# Altium schematic sheet MCU.SchDoc
size A; SheetNumber: 4; SheetTotal: 6
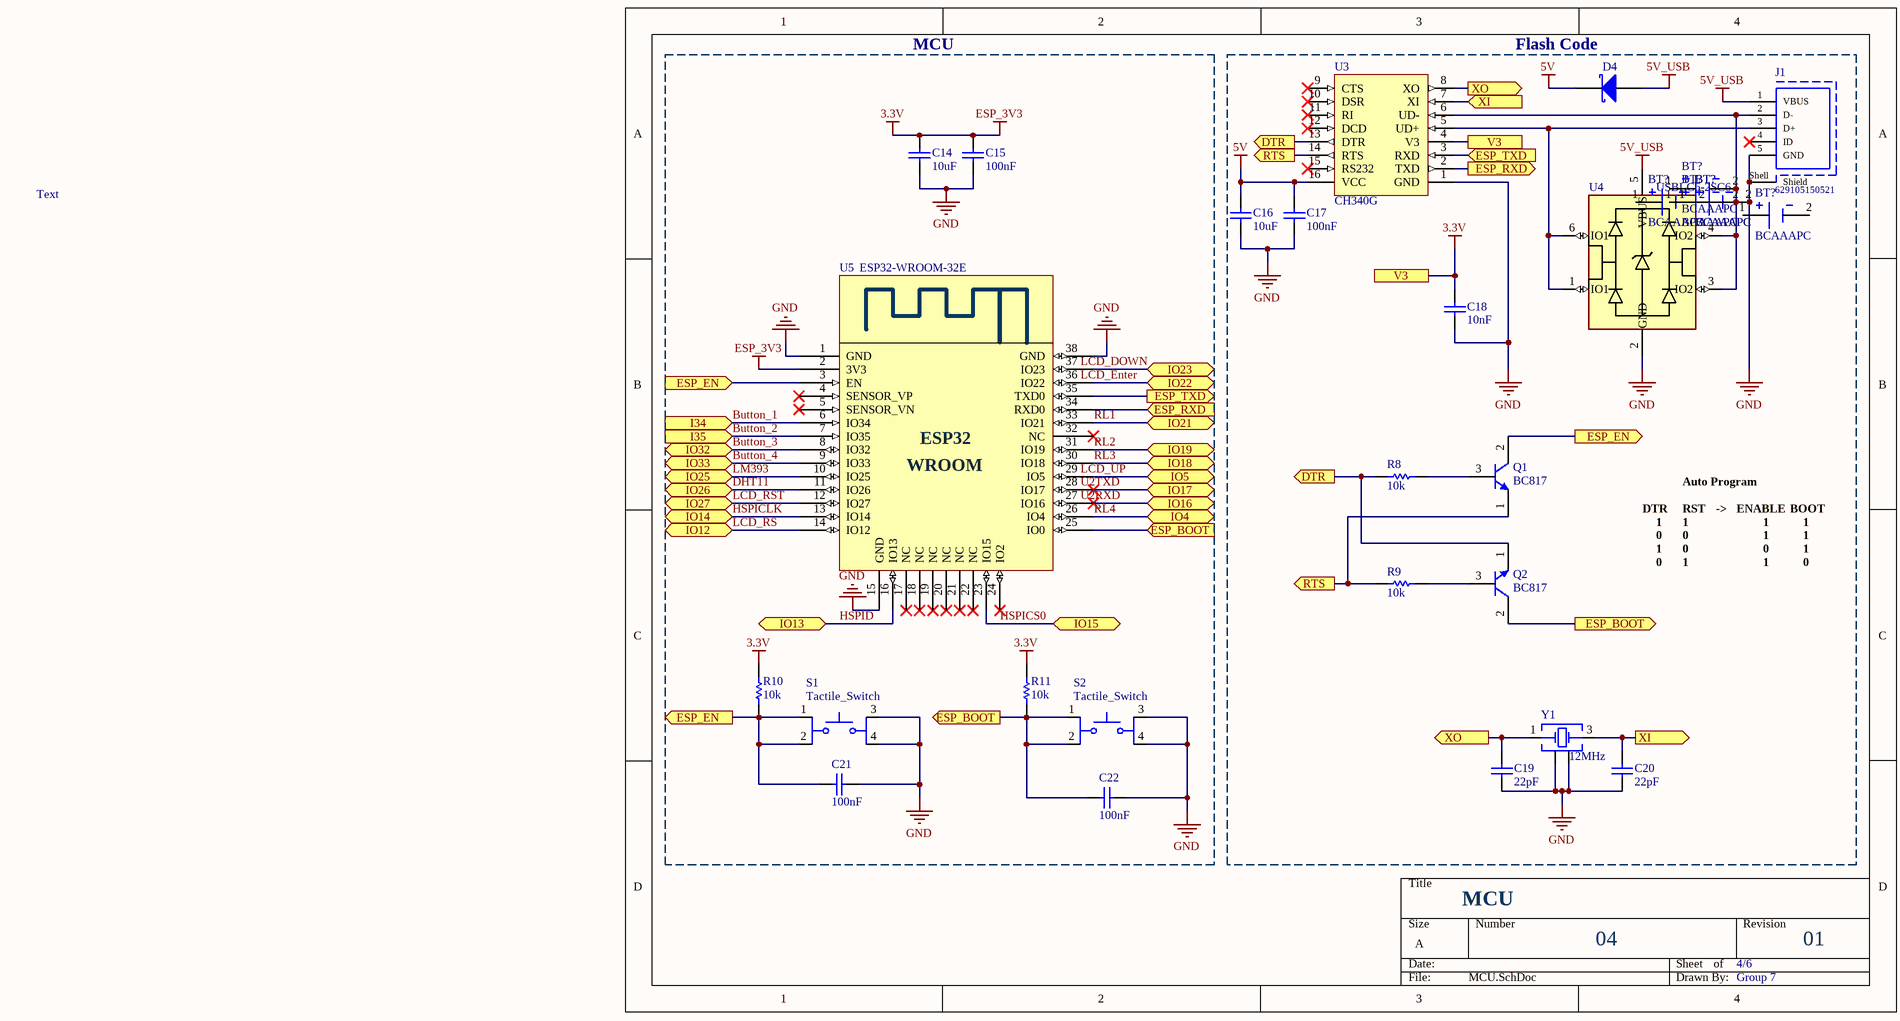
[diagram p0: MCU.SchDoc, left]
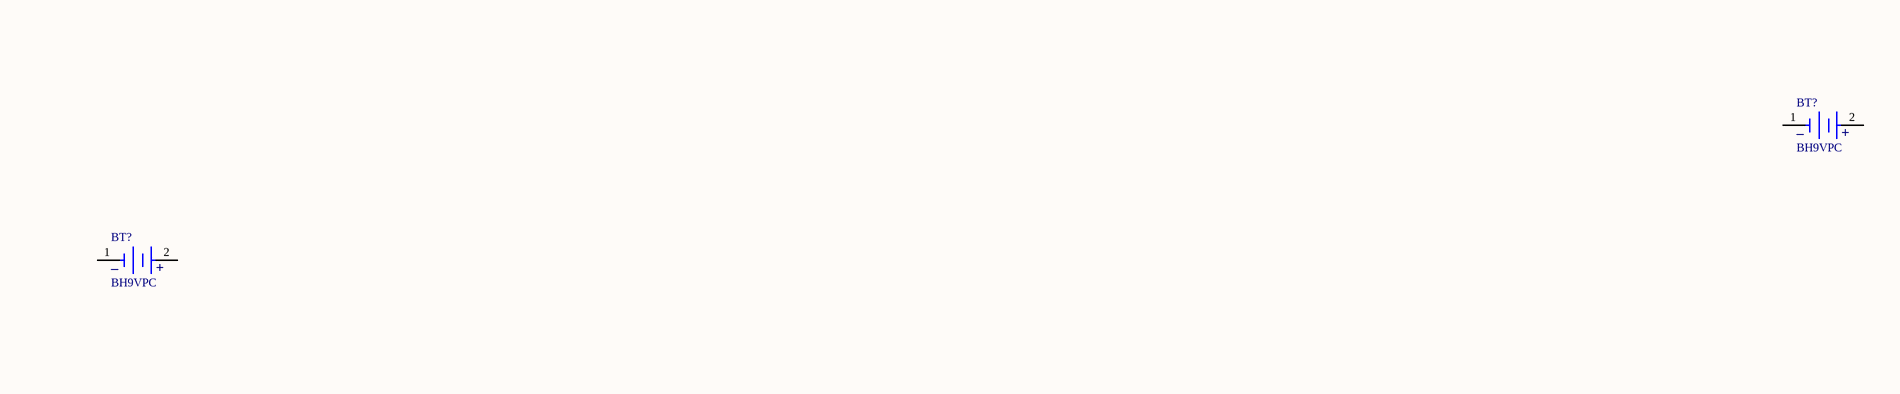
[diagram p1: MCU.SchDoc, right]

## Parts
(Parts that share a designator on the sheet are numbered #1, #2 ... from top to bottom, then left to right.)
BT?#1  BCAAAPC  [BCAAAPC]
BT?#2  BCAAAPC  [BCAAAPC]
BT?#3  BCAAAPC  [BCAAAPC]
BT?#4  BCAAAPC  [BCAAAPC]
BT?#5  BCAAAPC  [BCAAAPC]
BT?#6  BCAAAPC  [BCAAAPC]
BT?#7  BH9VPC  [FP-BH9VPC-MFG]
BT?#8  BH9VPC  [FP-BH9VPC-MFG]
C14  10uF  [CAP_0603]
C15  100nF  [CAP_0603]
C16  10uF  [CAP_0603]
C17  100nF  [CAP_0603]
C18  10nF  [CAP_0603]
C19  22pF  [CAP_0603]
C20  22pF  [CAP_0603]
C21  100nF  [CAP_0603]
C22  100nF  [CAP_0603]
D4  D Schottky  [SS34]  (value not drawn)
J1  629105150521  [629105150521]
Q1  BC817  [SOT23B]
Q2  BC817  [SOT23B]
R8  10k  [resistor_0603]
R9  10k  [resistor_0603]
R10  10k  [resistor_0603]
R11  10k  [resistor_0603]
S1  Tactile_Switch  [Tactile_Button_3x4x2.5]
S2  Tactile_Switch  [Tactile_Button_3x4x2.5]
U3  CH340G  [DSIP-16]
U4  USBLC6-2SC6  [SOT95P280X145-6N]
U5  ESP32-WROOM-32E  [ESP32-WROOM]
Y1  12MHz  [WE-XTAL_CFPX-104]

## Blocks framed on the sheet
MCU: C14 C15 C21 C22 R10 R11 S1 S2 U5
Flash Code: BT?#1-BT?#6 C16-C20 D4 J1 Q1 Q2 R8 R9 U3 U4 Y1

## Ports
DTR (out), ESP_BOOT (in), ESP_BOOT (out), ESP_EN (in), ESP_EN (out), ESP_RXD (in), ESP_RXD (out), ESP_TXD (in), ESP_TXD (out), I34 (in), I35 (in), IO4 (bidir), IO5 (bidir), IO12 (bidir), IO13 (bidir), IO14 (bidir), IO15 (bidir), IO16 (bidir), IO17 (bidir), IO18 (bidir), IO19 (bidir), IO21 (bidir), IO22 (bidir), IO23 (bidir), IO25 (bidir), IO26 (bidir), IO27 (bidir), IO32 (bidir), IO33 (bidir), RTS (out), V3, XI (in), XI (out), XO (out)

## Nets
3.3V: C14.1 C15.1 C18.1 R10.1 R11.1 U3.4(V3) U5.2(3V3) ; port V3  [also labelled ESP_3V3]
5V: C16.2 C17.1 D4.2(K) U3.16(VCC)
5V_USB: D4.1(A) J1.1(VBUS) U4.5(VBUS)
GND: BT?#4.2(NEG) BT?#5.2(NEG) C14.2 C15.2 C16.1 C17.2 C18.2 C19.1 C20.1 C21.2 C22.2 J1.5(GND) J1.Shell(Shield) S1.3 S1.4 S2.3 S2.4 U3.1(GND) U4.2(GND) U5.1(GND) U5.15(GND) U5.38(GND) Y1.2(GND_&_Lid) Y1.4(GND_&_Lid)
Button_1: U5.6(IO34) ; port I34
Button_2: U5.7(IO35) ; port I35
Button_3: U5.8(IO32) ; port IO32
Button_4: U5.9(IO33) ; port IO33
DHT11: U5.11(IO26) ; port IO26
DTR: Q2.1(E) R8.1 U3.13(DTR) ; port DTR
ESP_BOOT: C22.1 Q2.2(C) R11.2 S2.1 S2.2 U5.25(IO0) ; port ESP_BOOT
ESP_EN: C21.1 Q1.2(C) R10.2 S1.1 S1.2 U5.3(EN) ; port ESP_EN
ESP_RXD: U3.2(TXD) U5.34(RXD0) ; port ESP_RXD
ESP_TXD: U3.3(RXD) U5.35(TXD0) ; port ESP_TXD
HSPICLK: U5.13(IO14) ; port IO14
HSPICS0: U5.23(IO15) ; port IO15
HSPID: U5.16(IO13) ; port IO13
IO5: U5.29(IO5) ; port IO5
IO16: U5.27(IO16) ; port IO16
IO17: U5.28(IO17) ; port IO17
IO22: U5.36(IO22) ; port IO22
IO23: U5.37(IO23) ; port IO23
LCD_RS: U5.14(IO12) ; port IO12
LCD_RST: U5.12(IO27) ; port IO27
LM393: U5.10(IO25) ; port IO25
RL1: U5.33(IO21) ; port IO21
RL2: U5.31(IO19) ; port IO19
RL3: U5.30(IO18) ; port IO18
RL4: U5.26(IO4) ; port IO4
RTS: Q1.1(E) R9.1 U3.14(RTS) ; port RTS
XI: C20.2 U3.7(XI) Y1.3(Crystal) ; port XI
XO: C19.2 U3.8(XO) Y1.1(Crystal) ; port XO
NetBT?#1_2: BT?#1.2(NEG) BT?#3.2(NEG) J1.2(D-) U3.6(UD-) U4.3(IO2) U4.4(IO2)
NetBT?#4_1: BT?#4.1(POS) BT?#5.1(POS)
NetJ1_3: J1.3(D+) U3.5(UD+) U4.1(IO1) U4.6(IO1)
NetQ1_3: Q1.3(B) R8.2
NetQ2_3: Q2.3(B) R9.2

Not connected (* = marked no-connect by the designer): BT?#1 1(POS); BT?#2 1(POS) 2(NEG); BT?#3 1(POS); BT?#6 1(POS) 2(NEG); BT?#7 1(NEG) 2(POS); BT?#8 1(NEG) 2(POS); J1 4(ID)*; U3 9(CTS)* 10(DSR)* 11(RI)* 12(DCD)* 15(RS232)*; U5 4(SENSOR_VP)* 5(SENSOR_VN)* 17(NC)* 18(NC)* 19(NC)* 20(NC)* 21(NC)* 22(NC)* 24(IO2)* 32(NC)*

## Notes on the sheet
- Text
- Auto Program
- DTR
- 1
- 0
- RST
- ->
- ENABLE
- BOOT
- MCU
- 04
- 4/6
- 01
- Group 7
- Labels drawn without touching a wire or pin: LCD_DOWN, LCD_Enter, LCD_UP, U2RXD, U2TXD
- (in symbol CMP-00029-00001-2) _; +
- (in symbol ESP32-WROOM) WROOM

## Library data of the parts
BT?#1-BT?#6 = CMP-00029-00004-2: BATTERY HOLDER AAA PC PIN; ComponentLink1Description: Local Supply (Thegioiic); ComponentLink1URL: https://www.thegioiic.com/hop-pin-1xaaa-xuyen-lo-han-pcb
BT?#7 BT?#8 = CMP-00029-00001-2: Battery Holder (Open) 9V 1 Cell PC Pin.; RoHS Compliant: Yes; Mounting Technology: THT; Pins: 2; ComponentLink1URL: https://www.thegioiic.com/de-pin-9v-han-pcb; ComponentLink1Description: Local Supply 1 (Thegioiic
C14 C16 = 01060310010: CAP, size 0603,10uF; Supply 2 name: Thegioiic; Capacitance Tolerance: +/-10%; ComponentLink1Description: Manufacturer; ComponentLink1URL: *; ComponentLink2Description: Datasheet; ComponentLink2URL: *; Operating Temperature: -55 to +125degC; Packaging: Tape and Reel; Supply 1 SN: *; Supply 1 name: *; Supply 1 URL: *; Supply 2 SN: *; Supply 2 URL: https://www.thegioiic.com/tu-gom-0603-10uf-16v; Dissipation Factor: *; Height: *; Mounting Technology: SMT; Size: 0603; Capacitance: 10uF; Technical Reference: *
C15 C17 C21 C22 = 01060310410: CAP, size 0603, 100nF; Supply 1 SN: 885012206095; Supply 1 name: Wurth Elektronik; Supply 2 name: Thegioiic; Capacitance Tolerance: +/-10%; ComponentLink1Description: Manufacturer; ComponentLink1URL: http://www.we-online.de; ComponentLink2Description: Datasheet; ComponentLink2URL: https://www.we-online.com/catalog/datasheet/885012206095.pdf; Operating Temperature: -55 to +125degC; Packaging: Tape and Reel; Supply 1 URL: https://www.we-online.com/en/components/products/WCAP-CSGP-50VDC?sq=885012206095R#885012206095R; Supply 2 SN: *; Supply 2 URL: https://www.thegioiic.com/tu-gom-0603-100nf-0-1uf-50v; Dissipation Factor: *; Height: *; Mounting Technology: SMT; Size: 0603; Capacitance: 100nF; Technical Reference: *
C18 = 01060310310: CAP, size 0603, 10nF; Supply 1 SN: 885012206089; Supply 1 name: Wurth Elektronik; Supply 2 name: Thegioiic; Capacitance Tolerance: +/-10%; ComponentLink1Description: Manufacturer; ComponentLink1URL: http://www.we-online.de; ComponentLink2Description: Datasheet; ComponentLink2URL: https://www.we-online.com/catalog/datasheet/885012206089.pdf; Operating Temperature: -55 to +125degC; Packaging: Tape and Reel; Supply 1 URL: https://www.we-online.com/en/components/products/WCAP-CSGP-50VDC?sq=885012206089#885012206089; Supply 2 SN: *; Supply 2 URL: https://www.thegioiic.com/tu-gom-0603-10nf-50v; Dissipation Factor: *; Height: *; Mounting Technology: SMT; Size: 0603; Capacitance: 10nF; Technical Reference: *
C19 C20 = 01060322010: CAP, size 0603, 22pF; Supply 2 name: Thegioiic; Capacitance Tolerance: +/-10%; ComponentLink1Description: Manufacturer; ComponentLink1URL: Thegioiic; ComponentLink2Description: Datasheet; ComponentLink2URL: *; Operating Temperature: -55 to +125degC; Packaging: Tape and Reel; Supply 1 SN: *; Supply 1 name: *; Supply 1 URL: *; Supply 2 SN: *; Supply 2 URL: https://www.thegioiic.com/tu-gom-0603-22pf-50v; *: *; Height: *; Mounting Technology: SMT; Size: 0603; Capacitance: 22pF; Technical Reference: *
D4 = D Schottky: Schottky Diode; Published: 8-Jun-2000; LatestRevisionDate: 17-Jul-2002; LatestRevisionNote: Re-released for DXP Platform.; PackageReference: SMB; Publisher: Altium Limited; PackageDescription: DO-214-AA/SMB; 2 C-Bend Leads; Body 5.3 x 3.6 mm, inc. leads (LxW); Code_JEDEC: DO-214-AA
J1 = 629105150521: Micro USB 2.0 Type B Receptacle WR-COM, Horizontal, SMT, with Pegs, High Current at Pin 1 & Pin 5; Rated Current: 3 A; Contact Resistance: 30 mOhm; Working Voltage: 30 VAC; ComponentLink1Description: Manufacturer; ComponentLink1URL: http://www.we-online.de; ComponentLink2Description: Datasheet; ComponentLink2URL: https://katalog.we-online.de/em/datasheet/629105150521.pdf; Part Number: 629105150521; Published Date: September 2018; Publisher: Wurth Elektronik; Orientation: Horizontal; Connector Type: Micro USB 2.0 Type B; Operating Temperature: -40 to 85 degC; Mounting Technology: SMT; Gender: Receptacle; Packaging: Tape and Reel
Q1 Q2 = BC817: NPN Bipolar Transistor
R8-R11 = 0006031031: RES, 10k Ohm, size 0603, 1%; Resistance Tolerant: +/-1%; Rated Power: 1/4W; Supply 1 Name: Mouser; Supply 1 SN: 755-ESR03EZPF1002; Supply 2 Name: Digikey; Supply 2 SN: RHM10KADTR-ND RHM10KADCT-ND RHM10KADDKR-ND; Resistance: 10k; Size: 0603; Mounting Technology: SMT; ComponentLink1Description: Datasheet link; ComponentLink1URL: https://fscdn.rohm.com/en/products/databook/datasheet/passive/resistor/chip_resistor/esr-e.pdf; ComponentLink2Description: Supply 1 URL; ComponentLink2URL: https://www.mouser.vn/ProductDetail/ROHM-Semiconductor/ESR03EZPF1002?qs=sGAEpiMZZMvdGkrng054t67Efho1F8r6CDeAsqwFse8%3D; ComponentLink3Description: Supply 2 URL; ComponentLink3URL: https://www.digikey.com/en/products/detail/rohm-semiconductor/ESR03EZPF1002/1983429
S1 S2 = Tactile_Switch: Tactile Switch, 3x4x2.5mm; MP: TL6700AF160QG; Supplier 1 URL: https://www.thegioiic.com/nut-nhan-3x4mm-cao-2-5mm-4-chan-smd; Package: None; Price: None; Availability: Unavailable; ComponentLink1Description: New link; ComponentLink1URL: *; Supplier 1 Name: Thegioiic
U3 = CH340: USB Bridge, USB to UART USB 2.0 UART Interface; Mfr: SparkFun Electronics; Standards: USB 2.0; Voltage - Supply: 3V ~ 3.6V; Current - Supply: 20mA; Protocol: USB; Function: Bridge, USB to UART; Interface: UART; Operating Temperature: -20°C ~ 70°C (TA); ComponentLink1Description: Thegioiic; ComponentLink1URL: https://www.thegioiic.com/ch340g; ComponentLink2Description: Datasheet; ComponentLink2URL: https://www.thegioiic.com/upload/documents/5d39d5f0043101a4c964078db79fe1bd.PDF
U4 = USBLC6-2SC6: 17V Clamp 5A (8/20Âµs) Ipp Tvs Diode Surface Mount SOT-23-6
U5 = ESP32-WROOM: Bluetooth, WiFi 802.11b/g/n, Bluetooth v4.2 +EDR, Class 1, 2 and 3 Transceiver Module 2.4GHz ~ 2.5GHz Integrated, Trace Surface Mount; Mfr: Espressif Systems; Utilized IC / Part: ESP32-D0WD-V3; Modulation: CCK, DSSS, OFDM; Data Rate: 150Mbps; Power - Output: 20dBm; Sensitivity: -98dBm; Serial Interfaces: ADC, GPIO, I²C, I²S, PWM, SDIO, SPI, UART; Memory Size: 4MB Flash, 448kB ROM, 536kB SRAM; Voltage - Supply: 3V ~ 3.6V; Category: RF and Wireless; Series: ESP32; RF Family/Standard: Bluetooth, WiFi; Protocol: 802.11b/g/n, Bluetooth v4.2 +EDR, Class 1, 2 and 3; Frequency: 2.4GHz ~ 2.5GHz; Antenna Type: Integrated, Trace; Mounting Type: Surface Mount; ComponentLink1Description: Hshop; ComponentLink1URL: https://hshop.vn/products/mach-thu-phat-wifi-ble-soc-esp32-v1; Operating Temperature: -40°C ~ 85°C; ComponentLink2Description: Datasheet; ComponentLink2URL: https://www.espressif.com/sites/default/files/russianDocumentation/esp32-wroom-32e_esp32-wroom-32ue_datasheet_en.pdf
Y1 = 830055999: WE-XTAL Quartz Crystal, SMT, CFPX-104, 12MHz, +/-30ppm; Manufacturer: Wurth Elektronik; Load Capacitance: 18pF; ComponentLink1Description: Manufacturer; ComponentLink1URL: http://www.we-online.de; ComponentLink2Description: Datasheet; ComponentLink2URL: https://katalog.we-online.com/pbs/datasheet/830055999.pdf; Operating Temperature: -40 to +85degC; Packaging: Tape and Reel; Manufacturer Part Number: 830055999; Published Date: July 2020; Size: CFPX-104; Frequency Stability: +/-30ppm; Frequency: 12MHz; Frequency Tolerance: +/-30ppm; Mounting Technology: SMT